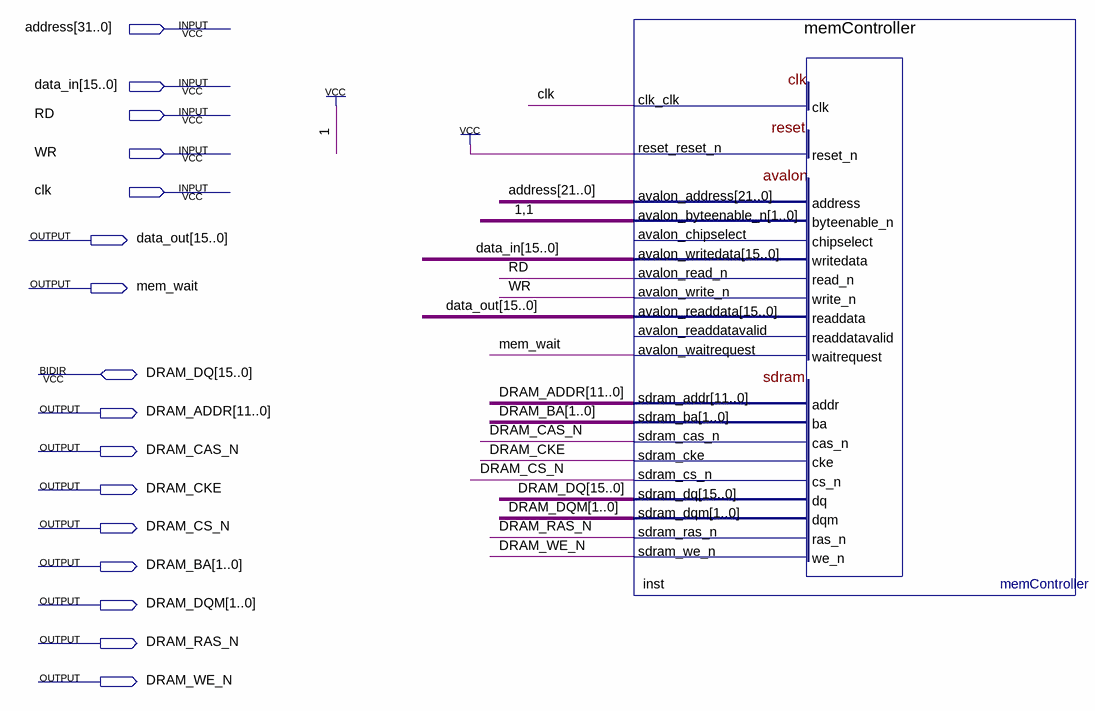
[diagram p0: schematic sheet]
// Quartus schematic MEM_MODULE.bdf as structural Verilog: 1 symbols, 16 pins
module MEM_MODULE (
  input  [31:0] address,
  input  [15:0] data_in,
  input  RD,
  input  WR,
  input  clk,
  inout  [15:0] DRAM_DQ,
  output [15:0] data_out,
  output mem_wait,
  output [11:0] DRAM_ADDR,
  output DRAM_CAS_N,
  output DRAM_CKE,
  output DRAM_CS_N,
  output [1:0] DRAM_BA,
  output [1:0] DRAM_DQM,
  output DRAM_RAS_N,
  output DRAM_WE_N
);

  memController inst (
    .clk_clk(clk), .reset_reset_n(1'b1), .avalon_address(address[21:0]), .avalon_byteenable_n(2'b11),
    .avalon_writedata(data_in), .avalon_read_n(RD), .avalon_write_n(WR), .avalon_readdata(data_out),
    .avalon_waitrequest(mem_wait), .sdram_addr(DRAM_ADDR), .sdram_ba(DRAM_BA), .sdram_cas_n(DRAM_CAS_N),
    .sdram_cke(DRAM_CKE), .sdram_cs_n(DRAM_CS_N), .sdram_dqm(DRAM_DQM), .sdram_ras_n(DRAM_RAS_N),
    .sdram_we_n(DRAM_WE_N), .sdram_dq(DRAM_DQ));  // open: avalon_chipselect, avalon_readdatavalid
endmodule
